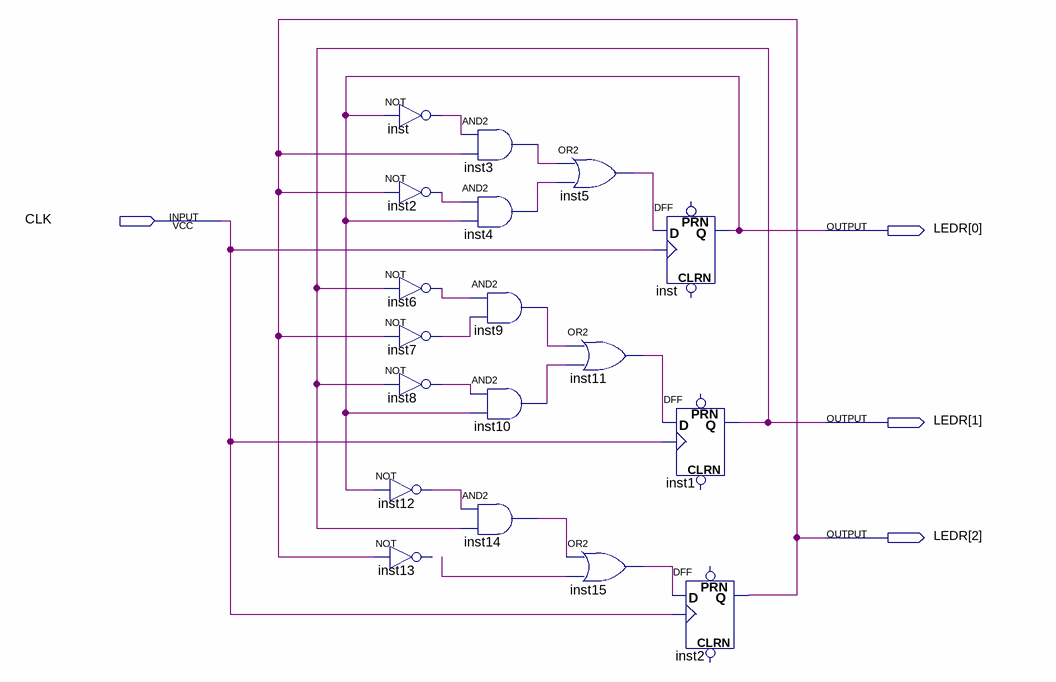
[diagram p0: schematic sheet]
// Quartus schematic Block2.bdf as structural Verilog: 18 symbols, 4 pins
module Block2 (
  input  CLK,
  output [2:0] LEDR
);

  wire inst2_out, inst3_out, inst4_out, inst5_out, inst6_out, inst7_out, inst8_out, inst9_out, inst10_out,
       inst11_out, inst12_out, inst14_out, inst15_out, inst_out, undriven;

  not inst (inst_out, LEDR[0]);
  not inst2 (inst2_out, LEDR[2]);
  not inst6 (inst6_out, LEDR[1]);
  not inst7 (inst7_out, LEDR[2]);
  not inst8 (inst8_out, LEDR[1]);
  not inst12 (inst12_out, LEDR[0]);
  // NOT inst13 has open pins: IN=LEDR[2], OUT=open
  and inst3 (inst3_out, inst_out, LEDR[2]);
  and inst4 (inst4_out, inst2_out, LEDR[0]);
  and inst9 (inst9_out, inst6_out, inst7_out);
  and inst10 (inst10_out, inst8_out, LEDR[0]);
  and inst14 (inst14_out, inst12_out, LEDR[1]);
  or inst5 (inst5_out, inst3_out, inst4_out);
  or inst11 (inst11_out, inst9_out, inst10_out);
  or inst15 (inst15_out, inst14_out, undriven);
  DFF inst_dup2 (.CLK(CLK), .D(inst5_out), .Q(LEDR[0]));  // open: CLRN, PRN
  DFF inst1 (.CLK(CLK), .D(inst11_out), .Q(LEDR[1]));  // open: CLRN, PRN
  DFF inst2_dup2 (.CLK(CLK), .D(inst15_out), .Q(LEDR[2]));  // open: CLRN, PRN
endmodule
